# Altium schematic sheet Sensor.SchDoc
size A4
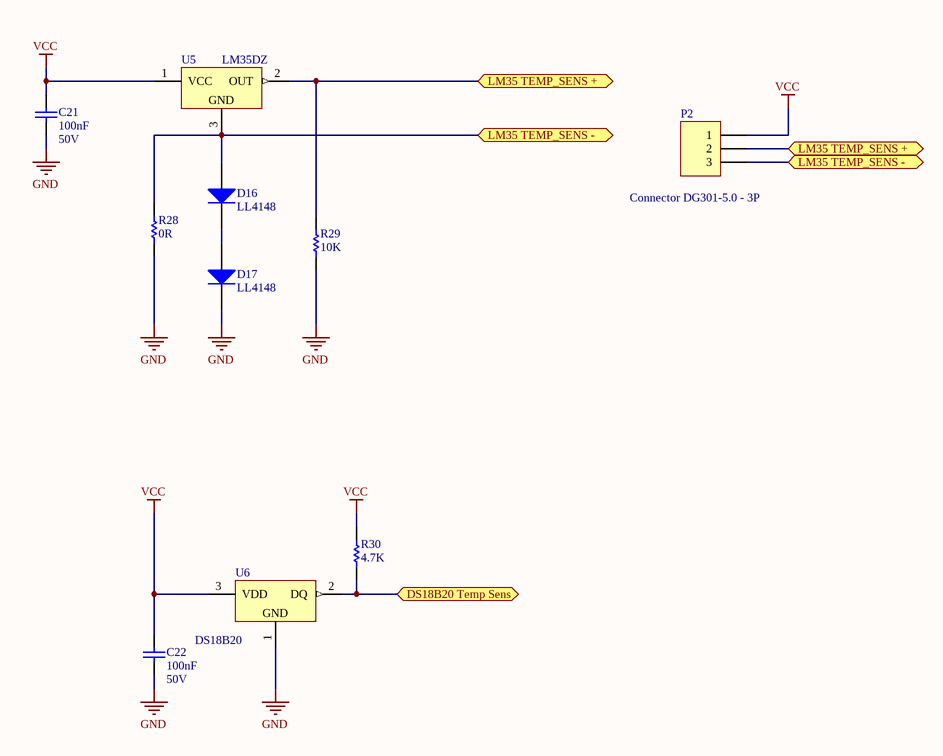
[diagram p0: Sensor.SchDoc]

## Parts
C21  value 100nF  Voltage: 50V  [3-0603_L]  (hidden comment: Cap)
C22  value 100nF  Voltage: 50V  [3-0603_L]  (hidden comment: Cap)
D16  LL4148  [DL-35 - S]
D17  LL4148  [DL-35 - S]
P2  Connector DG301-5.0 - 3P  [Connector DG301-5.0 - 3P]
R28  value 0R  [8-1206]  (hidden comment: Res1)
R29  value 10K  [3-0603_L]  (hidden comment: Res1)
R30  value 4.7K  [3-0603_L]  (hidden comment: Res1)
U5  LM35DZ  [TO-92 Big]
U6  DS18B20  [TO-92 Big]

## Ports
DS18B20 Temp Sens (bidir), LM35 TEMP_SENS + (bidir), LM35 TEMP_SENS - (bidir)

## Nets
GND: C21.1 C22.1 D17.2(K) R28.1 R29.1 U6.1(GND)
VCC: C21.2 C22.2 P2.1 R30.2 U5.1(VCC) U6.3(VDD)
DS18B20 Temp Sens: R30.1 U6.2(DQ) ; port DS18B20 Temp Sens
LM35 TEMP_SENS +: P2.2 R29.2 U5.2(OUT) ; port LM35 TEMP_SENS +
LM35 TEMP_SENS -: D16.1(A) P2.3 R28.2 U5.3(GND) ; port LM35 TEMP_SENS -
NetD16_2: D16.2(K) D17.1(A)

## Library data of the parts
C21 C22 = Cap: Capacitor; Published: 8-Jun-2000; Revision: July-2002: Re-released for DXP Platform.; Publisher: Altium Limited
D16 D17 = LL4148: 1 Amp General Purpose Rectifier; Published: 8-Jun-2000; LatestRevisionDate: 17-Jul-2002; LatestRevisionNote: Re-released for DXP Platform.; DatasheetDocument: 1998; PackageDocument: Aug-1999; Publisher: Altium Limited; Code_JEDEC: DO-204-AL; ComponentLink1Description: Manufacturer Link; ComponentLink1URL: http://www.fairchildsemi.com/; ComponentLink2Description: Datasheet; ComponentLink2URL: http://www.fairchildsemi.com/ds/1N%2F1N4001.pdf
P2 = Connector DG301-5.0 - 3P: Connector, 3-Pin; LatestRevisionDate: 17-Jul-2002; LatestRevisionNote: Re-released for DXP Platform.; Publisher: Altium Limited
R28-R30 = Res1: Resistor; Published: 8-Jun-2000; LatestRevisionDate: 17-Jul-2002; LatestRevisionNote: Re-released for DXP Platform.; PackageReference: AXIAL-0.3; Publisher: Altium Limited
U5 = LM35DZ: Temperature Sensor; Published: 24-Aug-2001; LatestRevisionDate: 06-Jun-2005; LatestRevisionNote: PCB pads lengthened.; DatasheetVersion: Mar-1997; PackageVersion: Jun-2004; PackageReference: TO-252; Publisher: Altium Limited; PackageDescription: D-PAK/TO-252-AA; 3 Leads (1 Cropped); Body 10.1 (inc. leads) x 6.6 mm (LxW max); ComponentLink1Description: Manufacturer Link; ComponentLink1URL: http://www.st.com/; ComponentLink2Description: Datasheet; ComponentLink2URL: http://www.st.com/stonline/products/literature/ds/2147/l78m05ab.pdf
U6 = DS18B20: 1-Wire Temperature Sensor; Published: 24-Aug-2001; LatestRevisionDate: 06-Jun-2005; LatestRevisionNote: PCB pads lengthened.; DatasheetVersion: Mar-1997; PackageVersion: Jun-2004; PackageReference: TO-252; Publisher: Altium Limited; PackageDescription: D-PAK/TO-252-AA; 3 Leads (1 Cropped); Body 10.1 (inc. leads) x 6.6 mm (LxW max); ComponentLink1Description: Manufacturer Link; ComponentLink1URL: http://www.st.com/; ComponentLink2Description: Datasheet; ComponentLink2URL: http://www.st.com/stonline/products/literature/ds/2147/l78m05ab.pdf